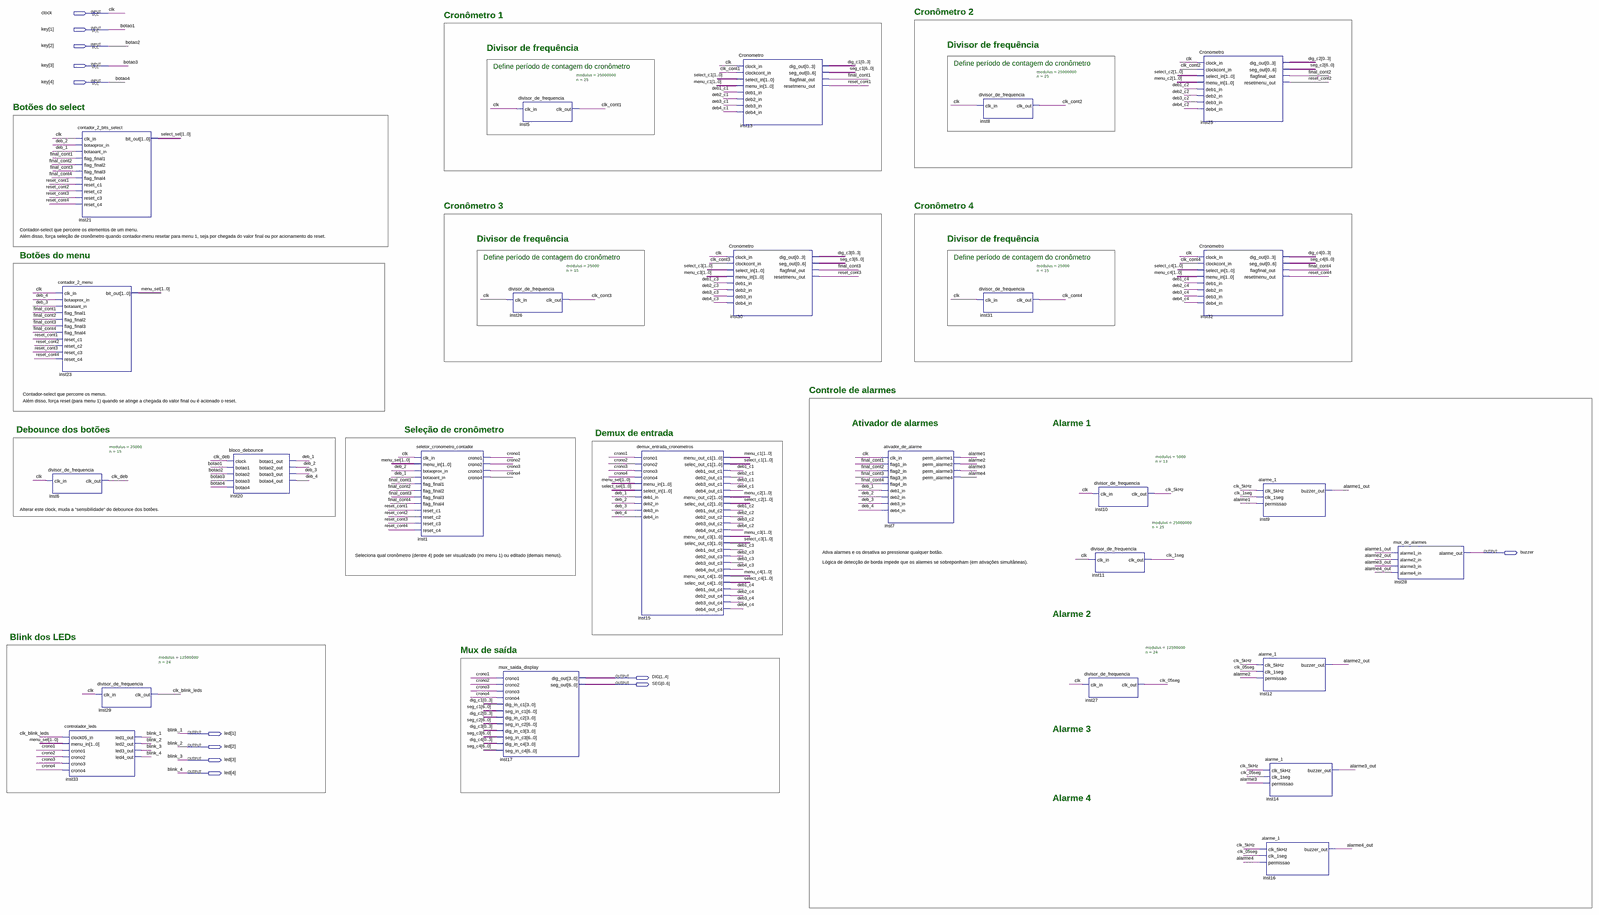
[diagram p0: schematic sheet, whole]
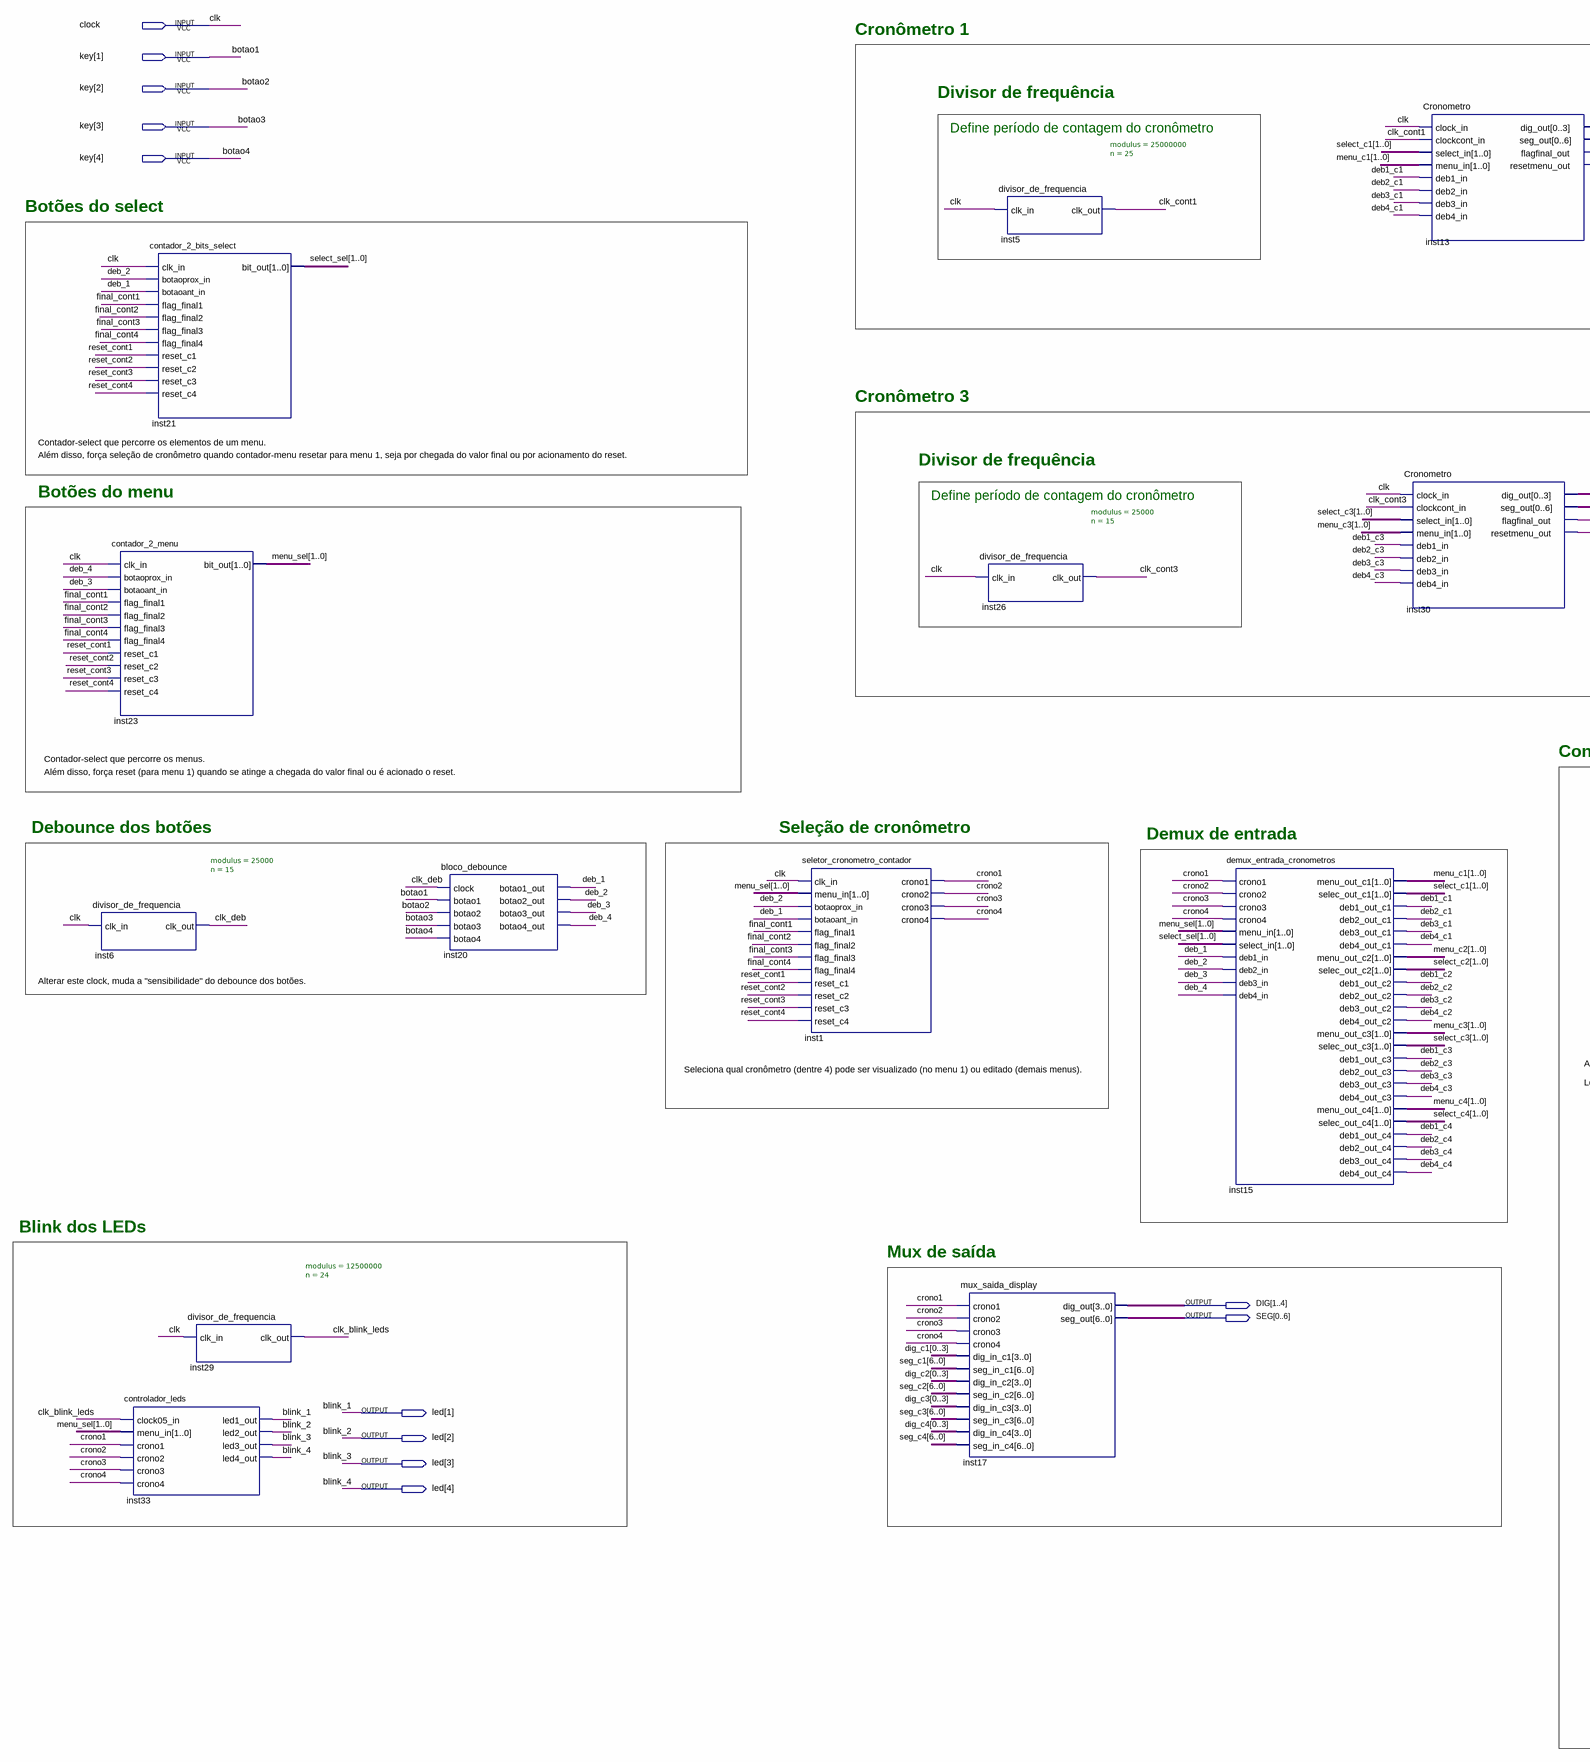
[diagram p1: schematic sheet, left part]
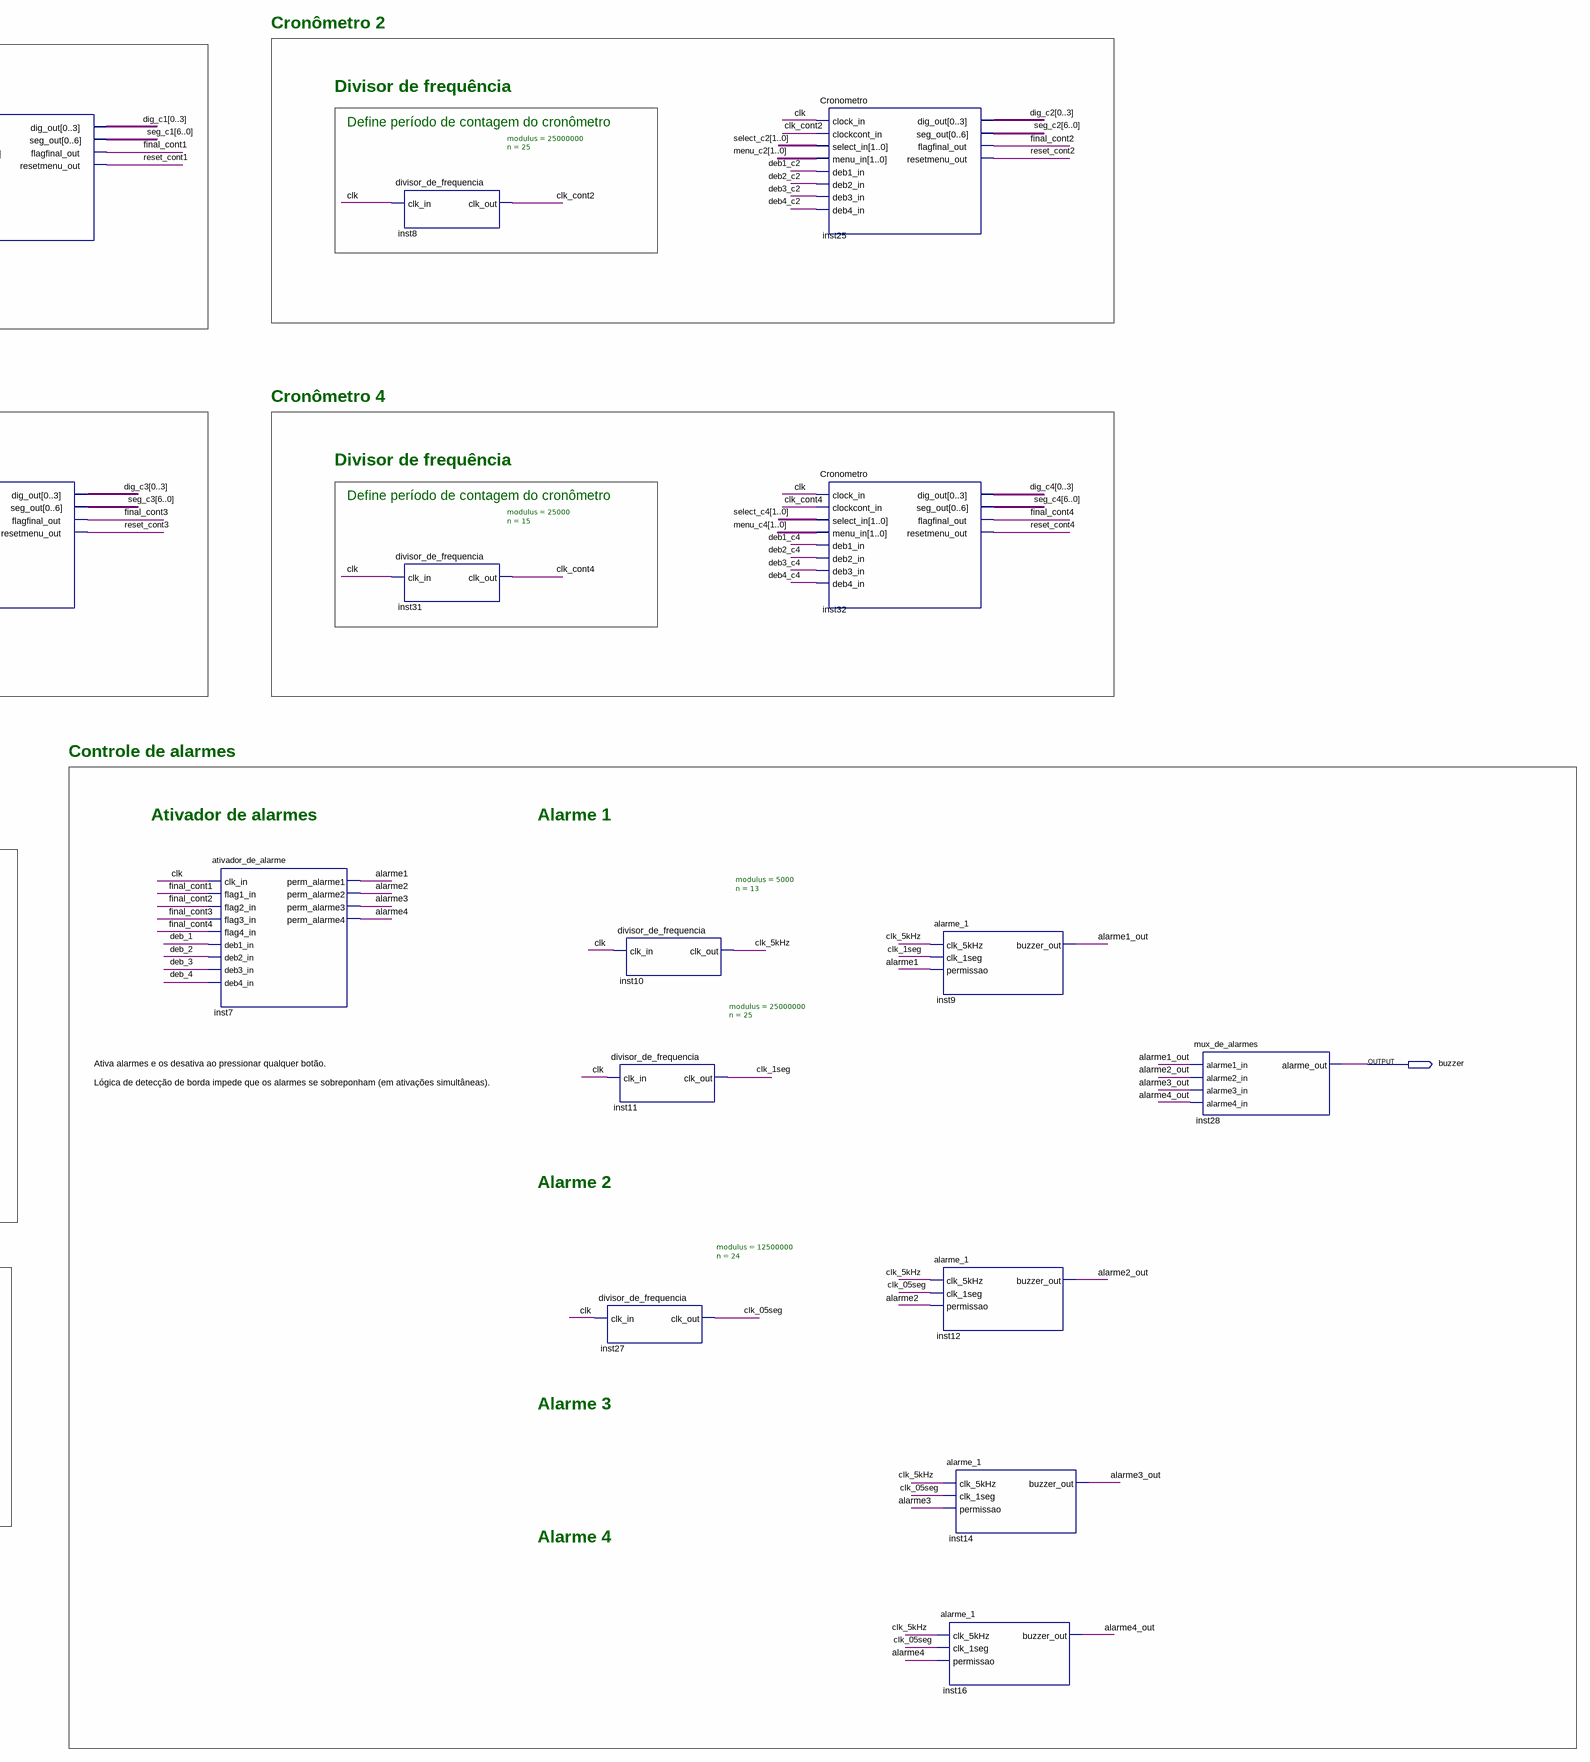
[diagram p2: schematic sheet, right part]
// Quartus schematic Projeto_02.bdf as structural Verilog: 26 symbols, 12 pins
module Projeto_02 (
  input  clock,
  input  [4:1] key,
  output buzzer,
  output [1:4] DIG,
  output [0:6] SEG,
  output [4:1] led
);

  wire alarme1, alarme1_out, alarme2, alarme2_out, alarme3, alarme3_out, alarme4, alarme4_out, clk_1seg,
       clk_5kHz, clk_05seg, clk_blink_leds, clk_cont1, clk_cont2, clk_cont3, clk_cont4, clk_deb, crono1,
       crono2, crono3, crono4, deb1_c1, deb1_c2, deb1_c3, deb1_c4, deb2_c1, deb2_c2, deb2_c3, deb2_c4,
       deb3_c1, deb3_c2, deb3_c3, deb3_c4, deb4_c1, deb4_c2, deb4_c3, deb4_c4, deb_1, deb_2, deb_3, deb_4,
       final_cont1, final_cont2, final_cont3, final_cont4, reset_cont1, reset_cont2, reset_cont3, reset_cont4;
  wire [1:0] menu_c1, menu_c2, menu_c3, menu_c4, menu_sel, select_c1, select_c2, select_c3, select_c4,
       select_sel;
  wire [3:0] dig_c1, dig_c2, dig_c3, dig_c4;
  wire [6:0] seg_c1, seg_c2, seg_c3, seg_c4;

  divisor_de_frequencia #(.modulus(25000), .n(15)) inst6 (.clk_in(clock), .clk_out(clk_deb));
  contador_2_bits_select inst21 (
    .clk_in(clock), .botaoprox_in(deb_2), .botaoant_in(deb_1), .flag_final1(final_cont1),
    .flag_final2(final_cont2), .flag_final3(final_cont3), .flag_final4(final_cont4), .reset_c1(reset_cont1),
    .reset_c2(reset_cont2), .reset_c3(reset_cont3), .reset_c4(reset_cont4), .bit_out(select_sel));
  contador_2_menu inst23 (
    .clk_in(clock), .botaoprox_in(deb_4), .botaoant_in(deb_3), .flag_final1(final_cont1),
    .flag_final2(final_cont2), .flag_final3(final_cont3), .flag_final4(final_cont4), .reset_c1(reset_cont1),
    .reset_c2(reset_cont2), .reset_c3(reset_cont3), .reset_c4(reset_cont4), .bit_out(menu_sel));
  controlador_leds inst33 (
    .clock05_in(clk_blink_leds), .menu_in(menu_sel), .crono1(crono1), .crono2(crono2), .crono3(crono3),
    .crono4(crono4), .led1_out(led[1]), .led2_out(led[2]), .led3_out(led[3]), .led4_out(led[4]));
  divisor_de_frequencia #(.modulus(12500000), .n(24)) inst29 (.clk_in(clock), .clk_out(clk_blink_leds));
  bloco_debounce inst20 (
    .clock(clk_deb), .botao1(key[1]), .botao2(key[2]), .botao3(key[3]), .botao4(key[4]), .botao1_out(deb_1),
    .botao2_out(deb_2), .botao3_out(deb_3), .botao4_out(deb_4));
  seletor_cronometro_contador inst1 (
    .clk_in(clock), .menu_in(menu_sel), .botaoprox_in(deb_2), .botaoant_in(deb_1), .flag_final1(final_cont1),
    .flag_final2(final_cont2), .flag_final3(final_cont3), .flag_final4(final_cont4), .reset_c1(reset_cont1),
    .reset_c2(reset_cont2), .reset_c3(reset_cont3), .reset_c4(reset_cont4), .crono1(crono1), .crono2(crono2),
    .crono3(crono3), .crono4(crono4));
  mux_saida_display inst17 (
    .crono1(crono1), .crono2(crono2), .crono3(crono3), .crono4(crono4),
    .dig_in_c1({dig_c1[0], dig_c1[1], dig_c1[2], dig_c1[3]}), .seg_in_c1(seg_c1),
    .dig_in_c2({dig_c2[0], dig_c2[1], dig_c2[2], dig_c2[3]}), .seg_in_c2(seg_c2),
    .dig_in_c3({dig_c3[0], dig_c3[1], dig_c3[2], dig_c3[3]}), .seg_in_c3(seg_c3),
    .dig_in_c4({dig_c4[0], dig_c4[1], dig_c4[2], dig_c4[3]}), .seg_in_c4(seg_c4), .dig_out(DIG), .seg_out(SEG));
  divisor_de_frequencia #(.modulus(25000000), .n(25)) inst5 (.clk_in(clock), .clk_out(clk_cont1));
  divisor_de_frequencia #(.modulus(25000), .n(15)) inst26 (.clk_in(clock), .clk_out(clk_cont3));
  demux_entrada_cronometros inst15 (
    .crono1(crono1), .crono2(crono2), .crono3(crono3), .crono4(crono4), .menu_in(menu_sel),
    .select_in(select_sel), .deb1_in(deb_1), .deb2_in(deb_2), .deb3_in(deb_3), .deb4_in(deb_4),
    .menu_out_c1(menu_c1), .selec_out_c1(select_c1), .deb1_out_c1(deb1_c1), .deb2_out_c1(deb2_c1),
    .deb3_out_c1(deb3_c1), .deb4_out_c1(deb4_c1), .menu_out_c2(menu_c2), .selec_out_c2(select_c2),
    .deb1_out_c2(deb1_c2), .deb2_out_c2(deb2_c2), .deb3_out_c2(deb3_c2), .deb4_out_c2(deb4_c2),
    .menu_out_c3(menu_c3), .selec_out_c3(select_c3), .deb1_out_c3(deb1_c3), .deb2_out_c3(deb2_c3),
    .deb3_out_c3(deb3_c3), .deb4_out_c3(deb4_c3), .menu_out_c4(menu_c4), .selec_out_c4(select_c4),
    .deb1_out_c4(deb1_c4), .deb2_out_c4(deb2_c4), .deb3_out_c4(deb3_c4), .deb4_out_c4(deb4_c4));
  Cronometro inst13 (
    .clock_in(clock), .clockcont_in(clk_cont1), .select_in(select_c1), .menu_in(menu_c1), .deb1_in(deb1_c1),
    .deb2_in(deb2_c1), .deb3_in(deb3_c1), .deb4_in(deb4_c1),
    .dig_out({dig_c1[0], dig_c1[1], dig_c1[2], dig_c1[3]}), .seg_out(seg_c1), .flagfinal_out(final_cont1),
    .resetmenu_out(reset_cont1));
  Cronometro inst30 (
    .clock_in(clock), .clockcont_in(clk_cont3), .select_in(select_c3), .menu_in(menu_c3), .deb1_in(deb1_c3),
    .deb2_in(deb2_c3), .deb3_in(deb3_c3), .deb4_in(deb4_c3),
    .dig_out({dig_c3[0], dig_c3[1], dig_c3[2], dig_c3[3]}), .seg_out(seg_c3), .flagfinal_out(final_cont3),
    .resetmenu_out(reset_cont3));
  ativador_de_alarme inst7 (
    .clk_in(clock), .flag1_in(final_cont1), .flag2_in(final_cont2), .flag3_in(final_cont3),
    .flag4_in(final_cont4), .deb1_in(deb_1), .deb2_in(deb_2), .deb3_in(deb_3), .deb4_in(deb_4),
    .perm_alarme1(alarme1), .perm_alarme2(alarme2), .perm_alarme3(alarme3), .perm_alarme4(alarme4));
  divisor_de_frequencia #(.modulus(25000000), .n(25)) inst8 (.clk_in(clock), .clk_out(clk_cont2));
  divisor_de_frequencia #(.modulus(25000), .n(15)) inst31 (.clk_in(clock), .clk_out(clk_cont4));
  divisor_de_frequencia #(.modulus(5000), .n(13)) inst10 (.clk_in(clock), .clk_out(clk_5kHz));
  divisor_de_frequencia #(.modulus(25000000), .n(25)) inst11 (.clk_in(clock), .clk_out(clk_1seg));
  divisor_de_frequencia #(.modulus(12500000), .n(24)) inst27 (.clk_in(clock), .clk_out(clk_05seg));
  Cronometro inst25 (
    .clock_in(clock), .clockcont_in(clk_cont2), .select_in(select_c2), .menu_in(menu_c2), .deb1_in(deb1_c2),
    .deb2_in(deb2_c2), .deb3_in(deb3_c2), .deb4_in(deb4_c2),
    .dig_out({dig_c2[0], dig_c2[1], dig_c2[2], dig_c2[3]}), .seg_out(seg_c2), .flagfinal_out(final_cont2),
    .resetmenu_out(reset_cont2));
  Cronometro inst32 (
    .clock_in(clock), .clockcont_in(clk_cont4), .select_in(select_c4), .menu_in(menu_c4), .deb1_in(deb1_c4),
    .deb2_in(deb2_c4), .deb3_in(deb3_c4), .deb4_in(deb4_c4),
    .dig_out({dig_c4[0], dig_c4[1], dig_c4[2], dig_c4[3]}), .seg_out(seg_c4), .flagfinal_out(final_cont4),
    .resetmenu_out(reset_cont4));
  alarme_1 inst9 (.clk_5kHz(clk_5kHz), .clk_1seg(clk_1seg), .permissao(alarme1), .buzzer_out(alarme1_out));
  alarme_1 inst12 (.clk_5kHz(clk_5kHz), .clk_1seg(clk_05seg), .permissao(alarme2), .buzzer_out(alarme2_out));
  alarme_1 inst14 (.clk_5kHz(clk_5kHz), .clk_1seg(clk_05seg), .permissao(alarme3), .buzzer_out(alarme3_out));
  alarme_1 inst16 (.clk_5kHz(clk_5kHz), .clk_1seg(clk_05seg), .permissao(alarme4), .buzzer_out(alarme4_out));
  mux_de_alarmes inst28 (
    .alarme1_in(alarme1_out), .alarme2_in(alarme2_out), .alarme3_in(alarme3_out), .alarme4_in(alarme4_out),
    .alarme_out(buzzer));

  // Other names for the same wires on the sheet: blink_1 = led[1]; blink_2 = led[2]; blink_3 = led[3];
  //   blink_4 = led[4]; botao1 = key[1]; botao2 = key[2]; botao3 = key[3]; botao4 = key[4]; clk = clock

  // Notes on the sheet:
  //   Cronômetro 2
  //   Cronômetro 1
  //   Divisor de frequência
  //   Divisor de frequência
  //   Define período de contagem do cronômetro
  //   Define período de contagem do cronômetro
  //   Botões do select
  //   Cronômetro 3
  //   Cronômetro 4
  //   Contador-select que percorre os elementos de um menu. 
  //   Além disso, força seleção de cronômetro quando contador-menu resetar para menu 1, seja por chegada do valor final ou por acionamento do reset.
  //   Divisor de frequência
  //   Divisor de frequência
  //   Botões do menu
  //   Define período de contagem do cronômetro
  //   Define período de contagem do cronômetro
  //   Controle de alarmes
  //   Contador-select que percorre os menus. 
  //   Além disso, força reset (para menu 1) quando se atinge a chegada do valor final ou é acionado o reset.
  //   Ativador de alarmes
  //   Alarme 1
  //   Debounce dos botões
  //   Seleção de cronômetro
  //   Demux de entrada
  //   Alterar este clock, muda a "sensibilidade" do debounce dos botões.
  //   Ativa alarmes e os desativa ao pressionar qualquer botão. 
  //   Seleciona qual cronômetro (dentre 4) pode ser visualizado (no menu 1) ou editado (demais menus).
  //   Lógica de detecção de borda impede que os alarmes se sobreponham (em ativações simultâneas).
  //   Alarme 2
  //   Blink dos LEDs
  //   Mux de saída
  //   Alarme 3
  //   Alarme 4
endmodule
